# Altium project PCB_One.PrjPCB
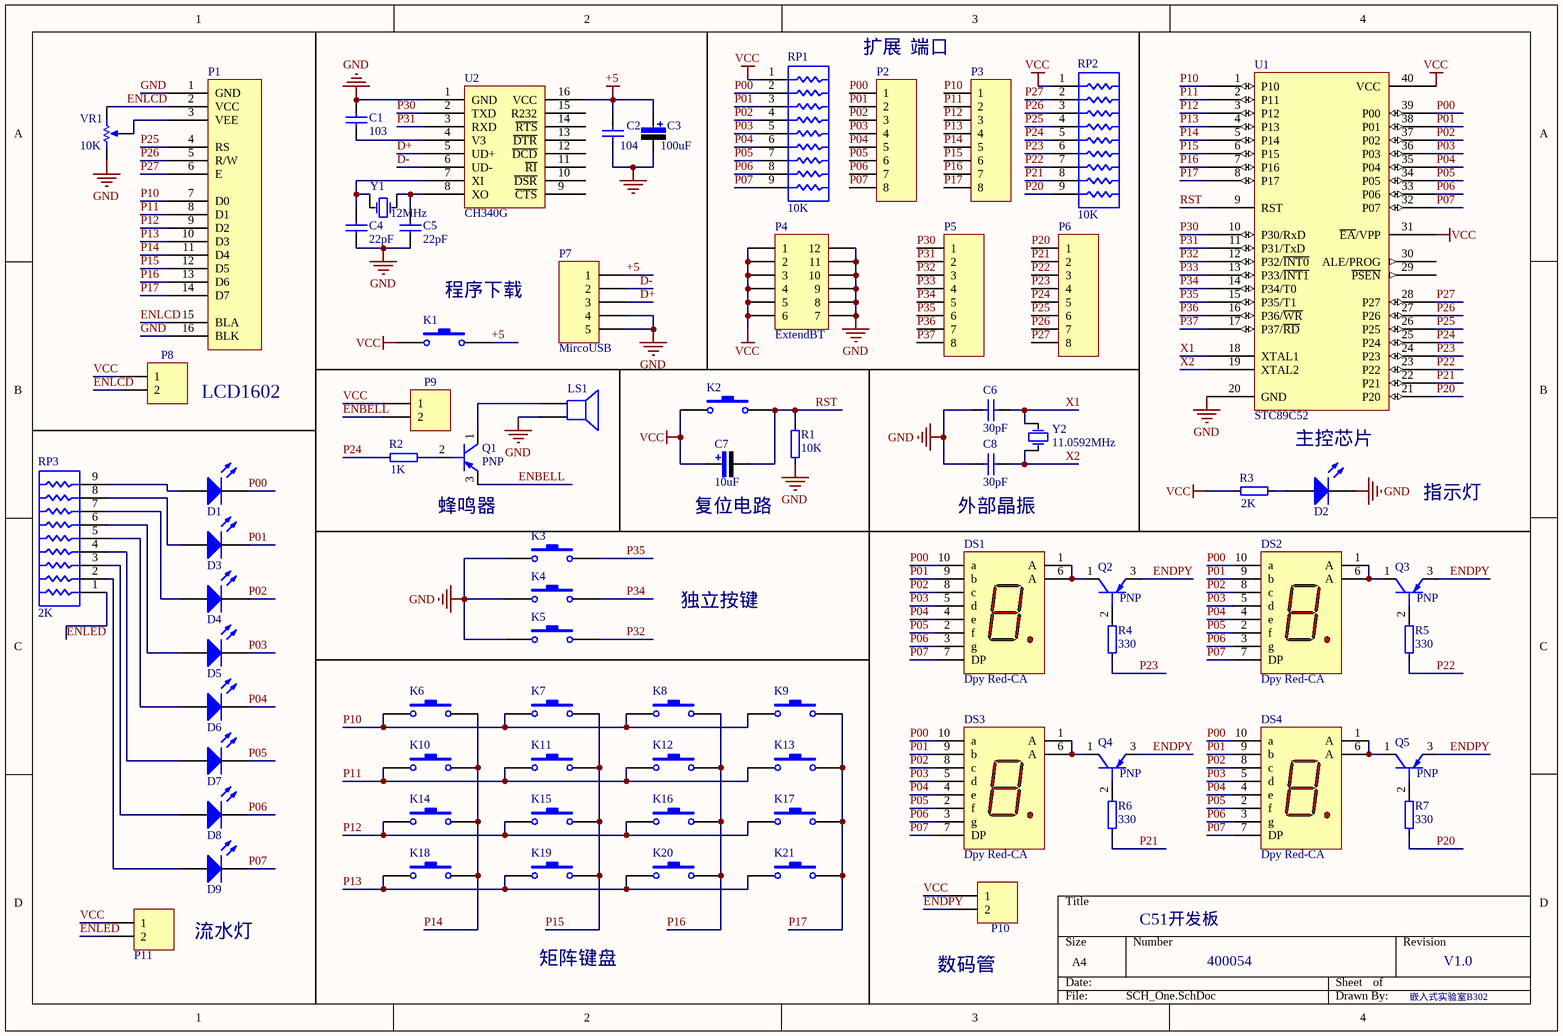
[diagram p0: SCH_One.SchDoc]
2 sheets, 161 parts. Net scope: global (net labels, ports and power ports of the same name join across sheets).
Board files: PCB_two.~(16).PcbDoc, PCB_One.PcbDoc, PCB_three.PcbDoc, PCB_second.PcbDoc, extpart.PcbDoc
Sheets:
  SCH_One.SchDoc
  extpart.SchDoc

## Sheet SCH_One.SchDoc
size A4

### Parts
C1  103  [C-RAD]
C2  104  [C-RAD]
C3  value 100uF  [CAP_100uF]  (hidden comment: Cap Pol)
C4  22pF  [C-RAD]
C5  22pF  [C-RAD]
C6  30pF  [C-RAD]
C7  value 10uF  [CAP_10uF]  (hidden comment: Cap Pol)
C8  30pF  [C-RAD]
D1  LED0  [LED3]  (value not drawn)
D2  LED0  [LED3]  (value not drawn)
D3  LED0  [LED3]  (value not drawn)
D4  LED0  [LED3]  (value not drawn)
D5  LED0  [LED3]  (value not drawn)
D6  LED0  [LED3]  (value not drawn)
D7  LED0  [LED3]  (value not drawn)
D8  LED0  [LED3]  (value not drawn)
D9  LED0  [LED3]  (value not drawn)
DS1  Dpy Red-CA  [A]
DS2  Dpy Red-CA  [A]
DS3  Dpy Red-CA  [A]
DS4  Dpy Red-CA  [A]
K1  Switch1  [KEY-6]  (value not drawn)
K2  Switch1  [SW_PB - 6.5x4.5]  (value not drawn)
K3  Switch1  [SW_PB - 6.5x4.5]  (value not drawn)
K4  Switch1  [SW_PB - 6.5x4.5]  (value not drawn)
K5  Switch1  [SW_PB - 6.5x4.5]  (value not drawn)
K6  Switch1  [SW_PB - 6.5x4.5]  (value not drawn)
K7  Switch1  [SW_PB - 6.5x4.5]  (value not drawn)
K8  Switch1  [SW_PB - 6.5x4.5]  (value not drawn)
K9  Switch1  [SW_PB - 6.5x4.5]  (value not drawn)
K10  Switch1  [SW_PB - 6.5x4.5]  (value not drawn)
K11  Switch1  [SW_PB - 6.5x4.5]  (value not drawn)
K12  Switch1  [SW_PB - 6.5x4.5]  (value not drawn)
K13  Switch1  [SW_PB - 6.5x4.5]  (value not drawn)
K14  Switch1  [SW_PB - 6.5x4.5]  (value not drawn)
K15  Switch1  [SW_PB - 6.5x4.5]  (value not drawn)
K16  Switch1  [SW_PB - 6.5x4.5]  (value not drawn)
K17  Switch1  [SW_PB - 6.5x4.5]  (value not drawn)
K18  Switch1  [SW_PB - 6.5x4.5]  (value not drawn)
K19  Switch1  [SW_PB - 6.5x4.5]  (value not drawn)
K20  Switch1  [SW_PB - 6.5x4.5]  (value not drawn)
K21  Switch1  [SW_PB - 6.5x4.5]  (value not drawn)
LS1  SPEAKER  [Beep]  (value not drawn)
P1  (no value)  [SIP16]
P2  Header 8  [SIP8 - duplicate]  (value not drawn)
P3  Header 8  [SIP8 - duplicate]  (value not drawn)
P4  ExtendBT  [HDR2x6]
P5  Header 8  [SIP8]  (value not drawn)
P6  Header 8  [SIP8 - duplicate]  (value not drawn)
P7  MircoUSB  [MircoUSB]
P8  Header 2  [HDR2X1_A]  (value not drawn)
P9  Header 2  [HDR2X1_A]  (value not drawn)
P10  Header 2  [HDR2X1_A]  (value not drawn)
P11  Header 2  [HDR2X1_A]  (value not drawn)
Q1  PNP  [TO-92]
Q2  PNP  [TO-92]
Q3  PNP  [TO-92]
Q4  PNP  [TO-92]
Q5  PNP  [TO-92]
R1  value 10K  [Res_DIP]  (hidden comment: Res)
R2  value 1K  [Res_DIP]  (hidden comment: Res)
R3  value 2K  [Res_DIP]  (hidden comment: Res)
R4  value 330  [Res_DIP]  (hidden comment: Res)
R5  value 330  [Res_DIP]  (hidden comment: Res)
R6  value 330  [Res_DIP]  (hidden comment: Res)
R7  value 330  [Res_DIP]  (hidden comment: Res)
RP1  10K  [SIP9 - duplicate]
RP2  10K  [SIP9 - duplicate]
RP3  2K  [SIP9 - duplicate]
U1  STC89C52  [DIP40]
U2  CH340G  [SOP-16]
VR1  10K  [VR4]
Y1  value 12MHz  [XTAL1]  (hidden comment: XTAL)
Y2  value 11.0592MHz  [XTAL1]  (hidden comment: XTAL)

### Nets
+5: C2.2 C3.1 K1.2 P7.1 U2.16(VCC)
GND: C1.2 C2.1 C3.2 C4.1 C5.1 C6.1 C8.1 D2.K K3.1 K4.1 K5.1 LS1.2 P1.1(GND) P1.16(BLK) P4.7 P4.8 P4.9 P4.10 P4.11 P4.12 P7.4 P7.5 R1.1 U1.20(GND) U2.1(GND) VR1.3(BOT)
VCC: C7.1 K1.1 K2.1 P4.1 P4.2 P4.3 P4.4 P4.5 P4.6 P8.1 P9.1 P10.1 P11.1 R3.1 RP1.1 RP2.1 U1.31(~{EA}/VPP) U1.40(VCC)
D+: P7.3 U2.5(UD+)
D-: P7.2 U2.6(UD-)
ENBELL: P9.2 Q1.3(EMITTER)
ENDPY: P10.2 Q2.3(EMITTER) Q3.3(EMITTER) Q4.3(EMITTER) Q5.3(EMITTER)
ENLCD: P1.2(VCC) P1.15(BLA) P8.2 VR1.1(TOP)
ENLED: P11.2 RP3.1
P00: D1.K DS1.10(a) DS2.10(a) DS3.10(a) DS4.10(a) P2.1 RP1.2 U1.39(P00)
P01: D3.K DS1.9(b) DS2.9(b) DS3.9(b) DS4.9(b) P2.2 RP1.3 U1.38(P01)
P02: D4.K DS1.8(c) DS2.8(c) DS3.8(c) DS4.8(c) P2.3 RP1.4 U1.37(P02)
P03: D5.K DS1.5(d) DS2.5(d) DS3.5(d) DS4.5(d) P2.4 RP1.5 U1.36(P03)
P04: D6.K DS1.4(e) DS2.4(e) DS3.4(e) DS4.4(e) P2.5 RP1.6 U1.35(P04)
P05: D7.K DS1.2(f) DS2.2(f) DS3.2(f) DS4.2(f) P2.6 RP1.7 U1.34(P05)
P06: D8.K DS1.3(g) DS2.3(g) DS3.3(g) DS4.3(g) P2.7 RP1.8 U1.33(P06)
P07: D9.K DS1.7(DP) DS2.7(DP) DS3.7(DP) DS4.7(DP) P2.8 RP1.9 U1.32(P07)
P10: K6.1 K7.1 K8.1 K9.1 P1.7(D0) P3.1 U1.1(P10)
P11: K10.1 K11.1 K12.1 K13.1 P1.8(D1) P3.2 U1.2(P11)
P12: K14.1 K15.1 K16.1 K17.1 P1.9(D2) P3.3 U1.3(P12)
P13: K18.1 K19.1 K20.1 K21.1 P1.10(D3) P3.4 U1.4(P13)
P14: K6.2 K10.2 K14.2 K18.2 P1.11(D4) P3.5 U1.5(P14)
P15: K7.2 K11.2 K15.2 K19.2 P1.12(D5) P3.6 U1.6(P15)
P16: K8.2 K12.2 K16.2 K20.2 P1.13(D6) P3.7 U1.7(P16)
P17: K9.2 K13.2 K17.2 K21.2 P1.14(D7) P3.8 U1.8(P17)
P20: P6.1 R7.1 RP2.9 U1.21(P20)
P21: P6.2 R6.1 RP2.8 U1.22(P21)
P22: P6.3 R5.1 RP2.7 U1.23(P22)
P23: P6.4 R4.1 RP2.6 U1.24(P23)
P24: P6.5 R2.1 RP2.5 U1.25(P24)
P25: P1.4(RS) P6.6 RP2.4 U1.26(P25)
P26: P1.5(R/W) P6.7 RP2.3 U1.27(P26)
P27: P1.6(E) P6.8 RP2.2 U1.28(P27)
P30: P5.1 U1.10(P30/RxD) U2.2(TXD)
P31: P5.2 U1.11(P31/TxD) U2.3(RXD)
P32: K5.2 P5.3 U1.12(P32/~{INT0})
P33: P5.4 U1.13(P33/~{INT1})
P34: K4.2 P5.5 U1.14(P34/T0)
P35: K3.2 P5.6 U1.15(P35/T1)
P36: P5.7 U1.16(P36/~{WR})
P37: P5.8 U1.17(P37/~{RD})
RST: C7.2 K2.2 R1.2 U1.9(RST)
X1: C6.2 U1.18(XTAL1) Y2.1(OSC1)
X2: C8.2 U1.19(XTAL2) Y2.2(OSC2)
NetC1_1: C1.1 U2.4(V3)
NetC4_2: C4.2 U2.7(XI) Y1.2(OSC2)
NetC5_2: C5.2 U2.8(XO) Y1.1(OSC1)
NetD1_A: D1.A RP3.9
NetD2_A: D2.A R3.2
NetD3_A: D3.A RP3.8
NetD4_A: D4.A RP3.7
NetD5_A: D5.A RP3.6
NetD6_A: D6.A RP3.5
NetD7_A: D7.A RP3.4
NetD8_A: D8.A RP3.3
NetD9_A: D9.A RP3.2
NetDS1_1: DS1.1(A) DS1.6(A) Q2.1(COLLECTOR)
NetDS2_1: DS2.1(A) DS2.6(A) Q3.1(COLLECTOR)
NetDS3_1: DS3.1(A) DS3.6(A) Q4.1(COLLECTOR)
NetDS4_1: DS4.1(A) DS4.6(A) Q5.1(COLLECTOR)
NetLS1_1: LS1.1 Q1.1(COLLECTOR)
NetP1_3: P1.3(VEE) VR1.2(TAP)
NetQ1_2: Q1.2(BASE) R2.2
NetQ2_2: Q2.2(BASE) R4.2
NetQ3_2: Q3.2(BASE) R5.2
NetQ4_2: Q4.2(BASE) R6.2
NetQ5_2: Q5.2(BASE) R7.2

Not connected (* = marked no-connect by the designer): U1 29(~{PSEN}) 30(ALE/PROG); U2 9(~{CTS}) 10(~{DSR}) 11(~{RI}) 12(~{DCD}) 13(~{DTR}) 14(~{RTS}) 15(R232)

### Notes on the sheet
- (near P2) 扩展
- 端口
- 程序下载
- LCD1602
- 主控芯片
- (near Q1) 蜂鸣器
- (near C7) 复位电路
- 外部晶振
- 指示灯
- 独立按键
- C51开发板
- 流水灯
- 矩阵键盘
- (near P10) 数码管
- 400054
- V1.0
- 嵌入式实验室B302

### Library data of the parts
C1 C2 C4-C6 C8 = Cap1: 电容; Value: *
C3 C7 = Cap Pol: 极性电解电容; Vol: 16V; Published: 8-Jun-2000; LatestRevisionDate: 17-Jul-2002; LatestRevisionNote: Re-released for DXP Platform.; PackageReference: RB7.6-15; Publisher: Altium Limited
D1-D9 = LED0: 发光二极管; Published: 8-Jun-2000; LatestRevisionDate: 08-Jul-2005; LatestRevisionNote: Mech Layer 1 removed.; PackageReference: LED-0; Publisher: Altium Limited
DS1-DS4 = Dpy Red-CA: 7.62 mm Black Surface HER 7-Segment Display: CA, RH DP; MinimumIntensity: 360 ucd; Note: IF = 5 mA; Colour: High Efficiency Red (HER); Note: Pins 1 and 6 are redundant Anodes.; Published: 8-Jun-2000; LatestRevisionDate: 17-Dec-2003; LatestRevisionNote: Schematic revised, PCB Footprint replaced.; DatasheetVersion: 19-Feb-2002; PackageVersion: 11-Feb-2002; PackageReference: A; Publisher: Altium Limited; PackageDescription: LED, 7-Segment Display, 7.62 mm, RHD; 10 Leads; Row Space 5.08 mm; Pitch 2.54 mm; ComponentLink1Description: Manufacturer Link; ComponentLink1URL: http://www.agilent.com/
K1-K21 = Switch1: 按键/单刀单掷开关
P1 = 1602: 1602液晶显示器
P2 P3 P5 P6 = Header 8: 8PIN
P4 = Header 6x2: 6PIN两排
P7 = Header 5: 5PIN
P8-P11 = Header 2: 接插件; LatestRevisionDate: 17-Jul-2002; LatestRevisionNote: Re-released for DXP Platform.; Publisher: Altium Limited
Q1-Q5 = PNP: PNP Transistor
R1-R7 = Res: 直插电阻
RP1-RP3 = Res Pack2: 9PIN排阻; Value: *
U1 = AT89C51: C51单片机; Name: *
U2 = CH340G: USB-SERIAL
VR1 = VR: 可变电阻器; Value: *
Y1 Y2 = XTAL: 晶振; Published: 8-Jun-2000; LatestRevisionDate: 17-Jul-2002; LatestRevisionNote: Re-released for DXP Platform.; PackageReference: R38; Publisher: Altium Limited

## Sheet extpart.SchDoc
size A4
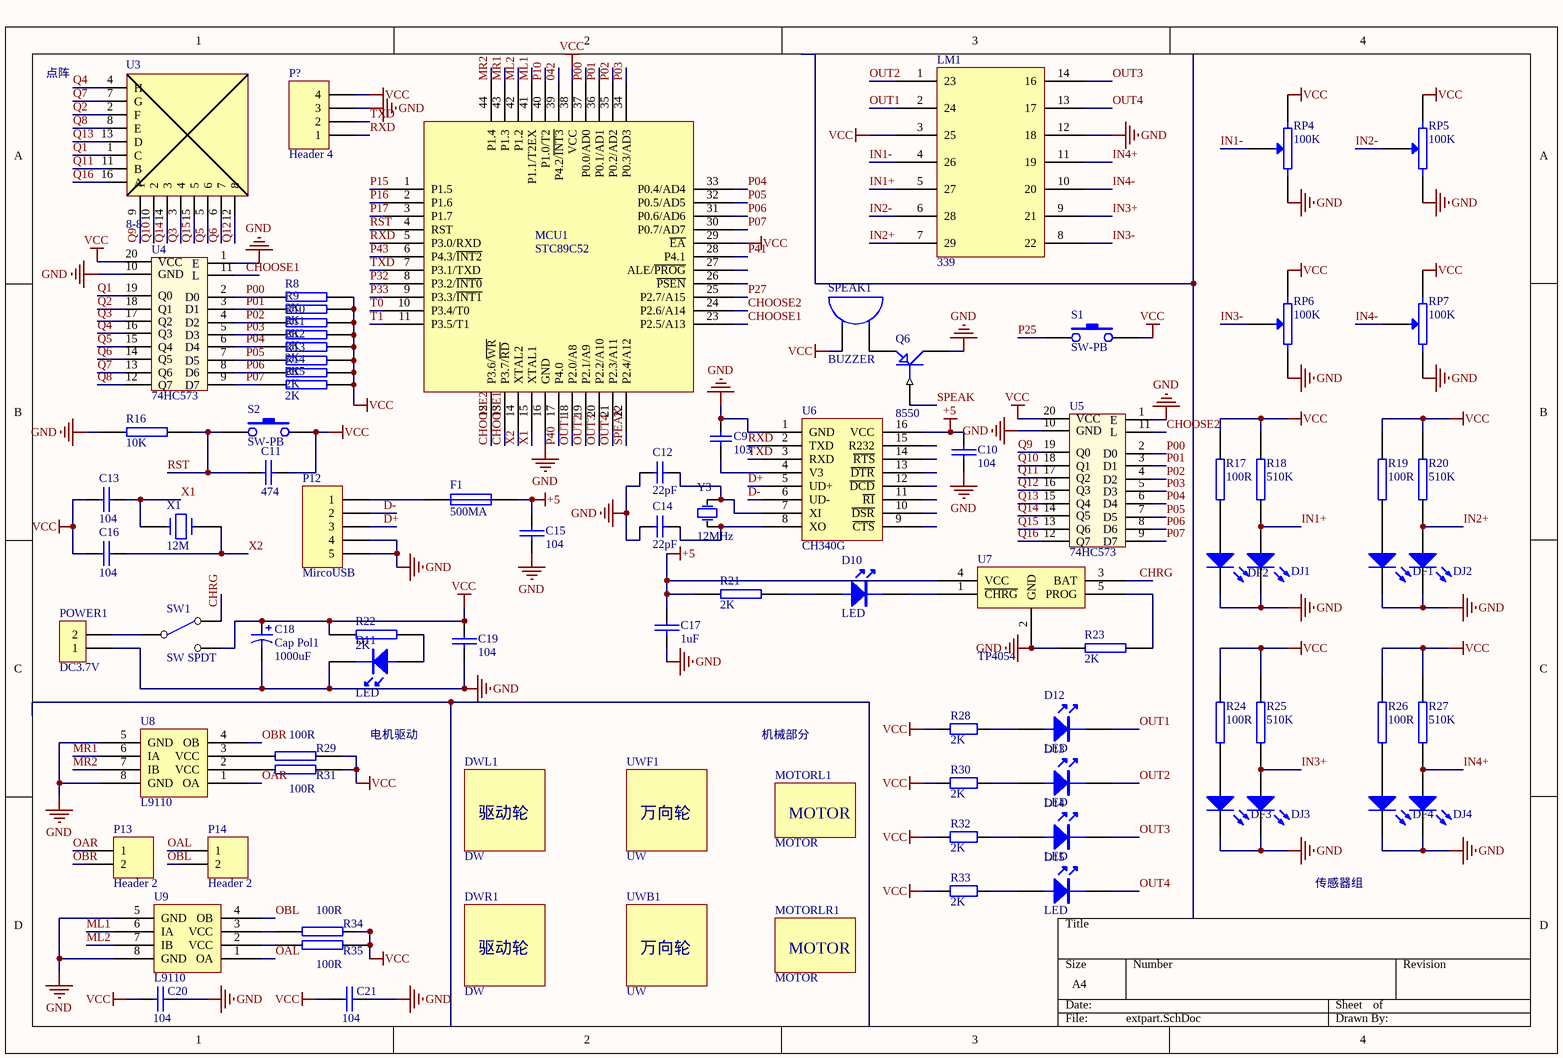
[diagram p1: extpart.SchDoc]

### Parts
C9  value 103  [C-RAD-0805]  (hidden comment: Cap)
C10  104  [0805C]
C11  474  [0805C]
C12  value 22pF  [C-RAD-0805]  (hidden comment: Cap)
C13  104  [0805C]
C14  value 22pF  [C-RAD-0805]  (hidden comment: Cap)
C15  104  [0805C]
C16  104  [0805C]
C17  1uF  [0805C]
C18  Cap Pol1  value 1000uF  [RB7.6-15]
C19  104  [0805C]
C20  104  [0805C]
C21  104  [0805C]
D10  LED  [0805D]
D11  LED  [0805D]
D12  LED  [0805D]
D13  LED  [0805D]
D14  LED  [0805D]
D15  LED  [0805D]
DF1  LED0  [LED3]  (value not drawn)
DF2  LED0  [LED3]  (value not drawn)
DF3  LED0  [LED3]  (value not drawn)
DF4  LED0  [LED3]  (value not drawn)
DJ1  LED0  [LED3]  (value not drawn)
DJ2  LED0  [LED3]  (value not drawn)
DJ3  LED0  [LED3]  (value not drawn)
DJ4  LED0  [LED3]  (value not drawn)
DWL1  DW  [DW]
DWR1  DW  [DW]
F1  500MA  [0805R]
LM1  339  [SOP-14]
MCU1  STC89C52  [TQFP-44]
MOTORL1  MOTOR  [MOTOR]
MOTORLR1  MOTOR  [MOTOR]
P12  MircoUSB  [MircoUSB]
P13  Header 2  [HDR1X2]
P14  Header 2  [HDR1X2]
P?  Header 4  [HDR1X4]
POWER1  DC3.7V  [XH2.54-2P]
Q6  8550  [SOT-23-P]
R8  2K  [0805R]
R9  2K  [0805R]
R10  2K  [0805R]
R11  2K  [0805R]
R12  2K  [0805R]
R13  2K  [0805R]
R14  2K  [0805R]
R15  2K  [0805R]
R16  10K  [0805R]
R17  100R  [0805R]
R18  510K  [0805R]
R19  100R  [0805R]
R20  510K  [0805R]
R21  2K  [0805R]
R22  2K  [0805R]
R23  2K  [0805R]
R24  100R  [0805R]
R25  510K  [0805R]
R26  100R  [0805R]
R27  510K  [0805R]
R28  value 2K  [0805-1]  (hidden comment: Res1)
R29  100R  [0805R]
R30  value 2K  [0805-1]  (hidden comment: Res1)
R31  100R  [0805R]
R32  value 2K  [0805-1]  (hidden comment: Res1)
R33  value 2K  [0805-1]  (hidden comment: Res1)
R34  100R  [0805R]
R35  100R  [0805R]
RP4  100K  [VR-5]
RP5  100K  [VR-5]
RP6  100K  [VR-5]
RP7  100K  [VR-5]
S1  SW-PB  [SWITCH]
S2  SW-PB  [SWITCH]
SPEAK1  BUZZER  [BUZZ]
SW1  SW SPDT  [SW-1-2]
U3  8-8  [8-8点阵 - duplicate]
U4  74HC573  [SOP-20（1.27）]
U5  74HC573  [SOP-20（1.27）]
U6  CH340G  [SOP-16]
U7  TP4054  [SOT-23-5]
U8  L9110  [SO-8]
U9  L9110  [SO-8]
UWB1  UW  [UW]
UWF1  UW  [UW]
X1  12M  [XTAL2]
Y3  value 12MHz  [XTAL1]  (hidden comment: XTAL)

### Nets
+5: C10.1 C15.1 C17.1 F1.2 R21.1 U6.16(VCC) U7.4(VCC)
GND: C9.2 C10.2 C12.1 C14.1 C15.2 C17.2 C18.2 C19.2 C20.2 C21.2 D11.2 DF1.K DF2.K DF3.K DF4.K DJ1.K DJ2.K DJ3.K DJ4.K LM1.12(18) MCU1.16(GND) P12.4 P12.5 P?.3 POWER1.1 Q6.3(C) R16.1 R23.1 RP4.1 RP5.1 RP6.1 RP7.1 U4.1(E) U4.10(GND) U5.1(E) U5.10(GND) U6.1(GND) U7.2(GND) U8.5(GND) U8.8(GND) U9.5(GND) U9.8(GND)
VCC: C11.2 C13.2 C16.1 C18.1 C19.1 C20.1 C21.1 LM1.3(25) MCU1.29(~{EA}) MCU1.38(VCC) P?.4 R8.2 R9.2 R10.2 R11.2 R12.2 R13.2 R14.2 R15.2 R17.2 R18.2 R19.2 R20.2 R22.1 R24.2 R25.2 R26.2 R27.2 R28.1 R29.2 R30.1 R31.2 R32.1 R33.1 R34.2 R35.2 RP4.3 RP5.3 RP6.3 RP7.3 S1.2 S2.2 SPEAK1.1(A) SW1.3(NO) U4.20(VCC) U5.20(VCC)
042: MCU1.39(P4.2/~{INT3})
CHOOSE1: MCU1.13(P3.7/~{RD}) MCU1.23(P2.5/A13) U4.11(L)
CHOOSE2: MCU1.12(P3.6/~{WR}) MCU1.24(P2.6/A14) U5.11(L)
CHRG: SW1.2(NC) U7.3(BAT)
D+: P12.3 U6.5(UD+)
D-: P12.2 U6.6(UD-)
IN1+: DJ1.A LM1.5(27) R18.1
IN1-: LM1.4(26) RP4.2(W)
IN2+: DJ2.A LM1.7(29) R20.1
IN2-: LM1.6(28) RP5.2(W)
IN3+: DJ3.A LM1.9(21) R25.1
IN3-: LM1.8(22) RP6.2(W)
IN4+: DJ4.A LM1.11(19) R27.1
IN4-: LM1.10(20) RP7.2(W)
ML1: MCU1.41(P1.1/T2EX) U9.6(IA)
ML2: MCU1.42(P1.2) U9.7(IB)
MR1: MCU1.43(P1.3) U8.6(IA)
MR2: MCU1.44(P1.4) U8.7(IB)
OAL: P14.1 U9.1(OA)
OAR: P13.1 U8.1(OA)
OBL: P14.2 U9.4(OB)
OBR: P13.2 U8.4(OB)
OUT1: D12.2 LM1.2(24) MCU1.18(P2.0/A8)
OUT2: D13.2 LM1.1(23) MCU1.19(P2.1/A9)
OUT3: D14.2 LM1.14(16) MCU1.20(P2.2/A10)
OUT4: D15.2 LM1.13(17) MCU1.21(P2.3/A11)
P00: MCU1.37(P0.0/AD0) R8.1 U4.2(D0) U5.2(D0)
P01: MCU1.36(P0.1/AD1) R9.1 U4.3(D1) U5.3(D1)
P02: MCU1.35(P0.2/AD2) R10.1 U4.4(D2) U5.4(D2)
P03: MCU1.34(P0.3/AD3) R11.1 U4.5(D3) U5.5(D3)
P04: MCU1.33(P0.4/AD4) R12.1 U4.6(D4) U5.6(D4)
P05: MCU1.32(P0.5/AD5) R13.1 U4.7(D5) U5.7(D5)
P06: MCU1.31(P0.6/AD6) R14.1 U4.8(D6) U5.8(D6)
P07: MCU1.30(P0.7/AD7) R15.1 U4.9(D7) U5.9(D7)
P10: MCU1.40(P1.0/T2)
P15: MCU1.1(P1.5)
P16: MCU1.2(P1.6)
P17: MCU1.3(P1.7)
P25: S1.1
P27: MCU1.25(P2.7/A15)
P32: MCU1.8(P3.2/~{INT0})
P33: MCU1.9(P3.3/~{INT1})
P40: MCU1.17(P4.0)
P41: MCU1.28(P4.1)
P43: MCU1.6(P4.3/~{INT2})
Q1: U3.1(C) U4.19(Q0)
Q2: U3.2(F) U4.18(Q1)
Q3: U3.3(4) U4.17(Q2)
Q4: U3.4(H) U4.16(Q3)
Q5: U3.5(6) U4.15(Q4)
Q6: U3.6(7) U4.14(Q5)
Q7: U3.7(G) U4.13(Q6)
Q8: U3.8(E) U4.12(Q7)
Q9: U3.9(1) U5.19(Q0)
Q10: U3.10(2) U5.18(Q1)
Q11: U3.11(B) U5.17(Q2)
Q12: U3.12(8) U5.16(Q3)
Q13: U3.13(D) U5.15(Q4)
Q14: U3.14(3) U5.14(Q5)
Q15: U3.15(5) U5.13(Q6)
Q16: U3.16(A) U5.12(Q7)
RST: C11.1 MCU1.4(RST) R16.2 S2.1
RXD: MCU1.5(P3.0/RXD) P?.1 U6.2(TXD)
SPEAK: MCU1.22(P2.4/A12) Q6.1(B)
T0: MCU1.10(P3.4/T0)
T1: MCU1.11(P3.5/T1)
TXD: MCU1.7(P3.1/TXD) P?.2 U6.3(RXD)
X1: C13.1 MCU1.15(XTAL1) X1.2
X2: C16.2 MCU1.14(XTAL2) X1.1
NetC9_1: C9.1 U6.4(V3)
NetC12_2: C12.2 U6.7(XI) Y3.2(OSC2)
NetC14_2: C14.2 U6.8(XO) Y3.1(OSC1)
NetD10_1: D10.1 R21.2
NetD10_2: D10.2 U7.1(~{CHRG})
NetD11_1: D11.1 R22.2
NetD12_1: D12.1 R28.2
NetD13_1: D13.1 R30.2
NetD14_1: D14.1 R32.2
NetD15_1: D15.1 R33.2
NetDF1_A: DF1.A R19.1
NetDF2_A: DF2.A R17.1
NetDF3_A: DF3.A R24.1
NetDF4_A: DF4.A R26.1
NetF1_1: F1.1 P12.1
NetPOWER1_2: POWER1.2 SW1.1(COMMON)
NetQ6_2: Q6.2(E) SPEAK1.2(B)
NetR23_2: R23.2 U7.5(PROG)
NetR29_1: R29.1 U8.3(VCC)
NetR31_1: R31.1 U8.2(VCC)
NetR34_1: R34.1 U9.3(VCC)
NetR35_1: R35.1 U9.2(VCC)

Not connected (* = marked no-connect by the designer): MCU1 26(~{PSEN}) 27(ALE/~{PROG}); U6 9(~{CTS}) 10(~{DSR}) 11(~{RI}) 12(~{DCD}) 13(~{DTR}) 14(~{RTS}) 15(R232)

### Notes on the sheet
- 点阵
- 电机驱动
- (near MOTORL1) 机械部分
- 传感器组
- (in symbol DW) 驱动轮
- (in symbol UW) 万向轮

### Library data of the parts
C9 C12 C14 = Cap: 无极性电容; Published: 8-Jun-2000; LatestRevisionDate: 17-Jul-2002; LatestRevisionNote: Re-released for DXP Platform.; PackageReference: RAD-0.3; Publisher: Altium Limited
C10 C11 C13 C15-C17 C19-C21 = CAP: Capacitor
C18 = Cap Pol1: Polarized Capacitor (Radial); Published: 8-Jun-2000; LatestRevisionDate: 17-Jul-2002; LatestRevisionNote: Re-released for DXP Platform.; PackageReference: RB7.6-15; Publisher: Altium Limited; PackageDescription: Polarized Capacitor (Radial); 2 Leads
DF1-DF4 DJ1-DJ4 = LED0: 发光二极管; Published: 8-Jun-2000; LatestRevisionDate: 08-Jul-2005; LatestRevisionNote: Mech Layer 1 removed.; PackageReference: LED-0; Publisher: Altium Limited
DWL1 DWR1 = DW: driving wheel
F1 = FUSE1: Fuse
LM1 = Component_1
MCU1 = STC89C52RC-PQFP: MCU
P12 = Header 5: 5PIN
P13 P14 = Header 2: Header, 2-Pin; LatestRevisionDate: 17-Jul-2002; LatestRevisionNote: Re-released for DXP Platform.; Publisher: Altium Limited
P? = Header 4: Header, 4-Pin; LatestRevisionDate: 17-Jul-2002; LatestRevisionNote: Re-released for DXP Platform.; Publisher: Altium Limited
POWER1 = CON2: Connector
Q6 = PNP1: PNP Transistor
R8-R27 R29 R31 R34 R35 = RES2
R28 R30 R32 R33 = Res1: 贴片电阻; Published: 8-Jun-2000; LatestRevisionDate: 17-Jul-2002; LatestRevisionNote: Re-released for DXP Platform.; PackageReference: AXIAL-0.4; Publisher: Altium Limited
RP4-RP7 = POT2: Potentiometer
U3 = 8-8点阵: 8-8: RAD
U6 = CH340G: USB-SERIAL
UWB1 UWF1 = UW: universal wheel
X1 = CRYSTAL
Y3 = XTAL: 晶振; Published: 8-Jun-2000; LatestRevisionDate: 17-Jul-2002; LatestRevisionNote: Re-released for DXP Platform.; PackageReference: R38; Publisher: Altium Limited

## Nets that join several sheets
+5: SCH_One (5 pins), extpart (7 pins)
GND: SCH_One (26 pins), extpart (42 pins)
VCC: SCH_One (18 pins), extpart (46 pins)
D+: SCH_One (P7.3 U2.5), extpart (P12.3 U6.5)
D-: SCH_One (P7.2 U2.6), extpart (P12.2 U6.6)
P00: SCH_One (8 pins), extpart (MCU1.37 R8.1 U4.2 U5.2)
P01: SCH_One (8 pins), extpart (MCU1.36 R9.1 U4.3 U5.3)
P02: SCH_One (8 pins), extpart (MCU1.35 R10.1 U4.4 U5.4)
P03: SCH_One (8 pins), extpart (MCU1.34 R11.1 U4.5 U5.5)
P04: SCH_One (8 pins), extpart (MCU1.33 R12.1 U4.6 U5.6)
P05: SCH_One (8 pins), extpart (MCU1.32 R13.1 U4.7 U5.7)
P06: SCH_One (8 pins), extpart (MCU1.31 R14.1 U4.8 U5.8)
P07: SCH_One (8 pins), extpart (MCU1.30 R15.1 U4.9 U5.9)
P10: SCH_One (7 pins), extpart (MCU1.40)
P15: SCH_One (7 pins), extpart (MCU1.1)
P16: SCH_One (7 pins), extpart (MCU1.2)
P17: SCH_One (7 pins), extpart (MCU1.3)
P25: SCH_One (P1.4 P6.6 RP2.4 U1.26), extpart (S1.1)
P27: SCH_One (P1.6 P6.8 RP2.2 U1.28), extpart (MCU1.25)
P32: SCH_One (K5.2 P5.3 U1.12), extpart (MCU1.8)
P33: SCH_One (P5.4 U1.13), extpart (MCU1.9)
RST: SCH_One (C7.2 K2.2 R1.2 U1.9), extpart (C11.1 MCU1.4 R16.2 S2.1)
X1: SCH_One (C6.2 U1.18 Y2.1), extpart (C13.1 MCU1.15 X1.2)
X2: SCH_One (C8.2 U1.19 Y2.2), extpart (C16.2 MCU1.14 X1.1)